# Altium schematic sheet memory.SchDoc: Bison-Board
size A4; DrawnBy: mzy2364; Revision: V1.4
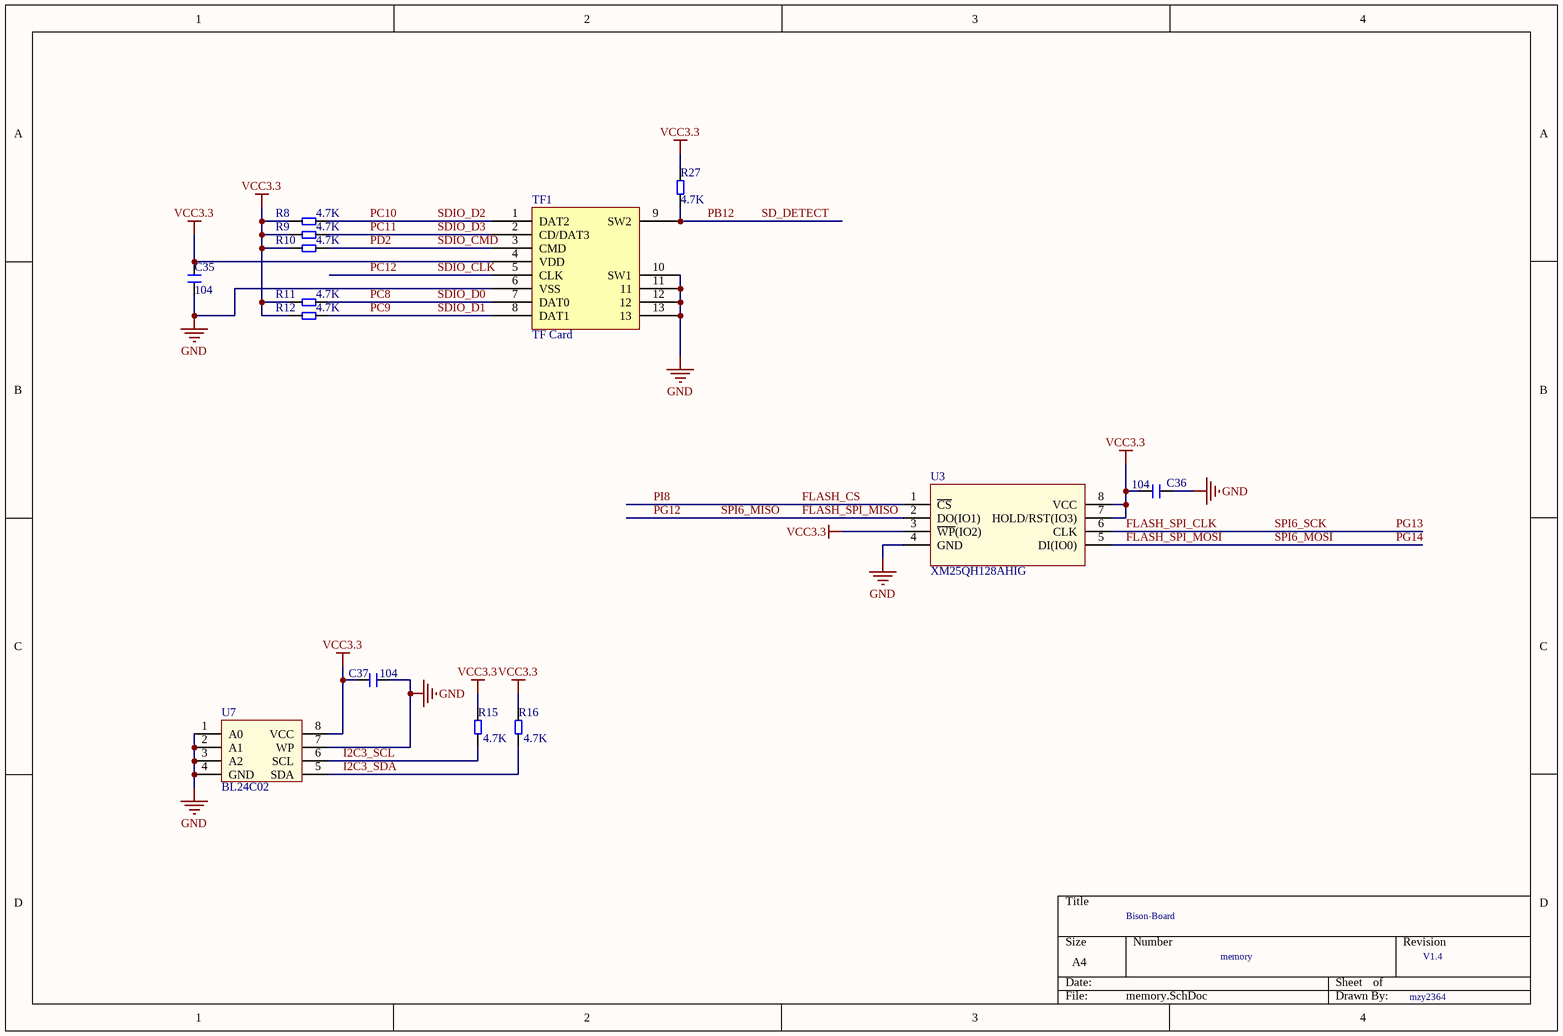
[diagram p0: memory.SchDoc]

## Parts
C35  104  [C 0603]
C36  104  [C 0603]
C37  104  [C 0603]
R8  4.7K  [R 0603]
R9  4.7K  [R 0603]
R10  4.7K  [R 0603]
R11  4.7K  [R 0603]
R12  4.7K  [R 0603]
R15  4.7K  [R 0603]
R16  4.7K  [R 0603]
R27  4.7K  [R 0603]
TF1  TF Card  [TF Card]
U3  XM25QH128AHIG  [SOIC-8-208mil]
U7  BL24C02  [SOP8]

## Nets
GND: C35.1 C36.2 C37.2 TF1.6(VSS) TF1.10(SW1) TF1.11 TF1.12 TF1.13 U3.4(GND) U7.1(A0) U7.2(A1) U7.3(A2) U7.4(GND) U7.7(WP)
VCC3.3: C35.2 C36.1 C37.1 R8.1 R9.1 R10.1 R11.1 R12.1 R15.2 R16.2 R27.2 TF1.4(VDD) U3.3(~{WP}(IO2)) U3.7(HOLD/RST(IO3)) U3.8(VCC) U7.8(VCC)
FLASH_CS: U3.1(~{CS})  [also labelled PI8]
FLASH_SPI_CLK: U3.6(CLK)  [also labelled PG13, SPI6_SCK]
FLASH_SPI_MISO: U3.2(DO(IO1))  [also labelled PG12, SPI6_MISO]
FLASH_SPI_MOSI: U3.5(DI(IO0))  [also labelled PG14, SPI6_MOSI]
I2C3_SCL: R15.1 U7.6(SCL)
I2C3_SDA: R16.1 U7.5(SDA)
PB12: R27.1 TF1.9(SW2)  [also labelled SD_DETECT]
PC8: R11.2 TF1.7(DAT0)  [also labelled SDIO_D0]
PC9: R12.2 TF1.8(DAT1)  [also labelled SDIO_D1]
PC10: R8.2 TF1.1(DAT2)  [also labelled SDIO_D2]
PC11: R9.2 TF1.2(CD/DAT3)  [also labelled SDIO_D3]
PC12: TF1.5(CLK)  [also labelled SDIO_CLK]
PD2: R10.2 TF1.3(CMD)  [also labelled SDIO_CMD]

## Notes on the sheet
- memory

## Library data of the parts
C35-C37 = CAP
R8-R12 R15 R16 R27 = RES
U3 = W25Q128
U7 = 24C02